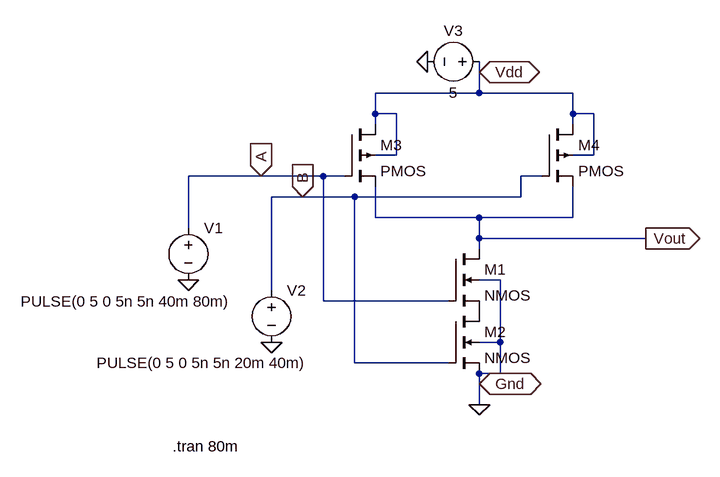
[diagram p0: schematic NAND.asc]
NAND.asc, the LTspice schematic file:
Version 4.1
SHEET 1 880 680
WIRE 288 -96 288 -112
WIRE 288 -64 288 -96
WIRE 288 -64 128 -64
WIRE 432 -64 288 -64
WIRE 128 -32 128 -64
WIRE 160 -32 128 -32
WIRE 432 -32 432 -64
WIRE 464 -32 432 -32
WIRE 128 -16 128 -32
WIRE 432 -16 432 -32
WIRE 160 32 160 -32
WIRE 160 32 128 32
WIRE 464 32 464 -32
WIRE 464 32 432 32
WIRE -48 64 -160 64
WIRE 48 64 -48 64
WIRE 80 64 48 64
WIRE 384 64 352 64
WIRE 16 96 -32 96
WIRE 96 96 16 96
WIRE 352 96 352 64
WIRE 352 96 96 96
WIRE 128 128 128 80
WIRE 288 128 128 128
WIRE 432 128 432 80
WIRE 432 128 288 128
WIRE -160 144 -160 64
WIRE 288 160 288 128
WIRE 544 160 288 160
WIRE 288 176 288 160
WIRE 320 224 288 224
WIRE -32 240 -32 96
WIRE 48 256 48 64
WIRE 240 256 48 256
WIRE 320 320 320 224
WIRE 320 320 288 320
WIRE 96 352 96 96
WIRE 240 352 96 352
WIRE 320 368 320 320
WIRE 320 368 288 368
WIRE 288 384 288 368
WIRE 288 416 288 384
FLAG 288 416 0
FLAG -32 320 0
FLAG -160 224 0
FLAG 208 -112 0
FLAG -48 64 A
IOPIN -48 64 In
FLAG 16 96 B
IOPIN 16 96 In
FLAG 288 -96 Vdd
IOPIN 288 -96 BiDir
FLAG 288 384 Gnd
IOPIN 288 384 BiDir
FLAG 544 160 Vout
IOPIN 544 160 Out
SYMBOL nmos4 240 176 R0
SYMATTR InstName M1
SYMBOL nmos4 240 272 R0
SYMATTR InstName M2
SYMBOL pmos4 80 -16 R0
SYMATTR InstName M3
SYMBOL pmos4 384 -16 R0
SYMATTR InstName M4
SYMBOL voltage -160 128 R0
WINDOW 3 -258 129 Left 2
WINDOW 123 0 0 Left 0
WINDOW 39 0 0 Left 0
SYMATTR Value PULSE(0 5 0 5n 5n 40m 80m)
SYMATTR InstName V1
SYMBOL voltage -32 224 R0
WINDOW 3 -269 128 Left 2
WINDOW 123 0 0 Left 0
WINDOW 39 0 0 Left 0
SYMATTR Value PULSE(0 5 0 5n 5n 20m 40m)
SYMATTR InstName V2
SYMBOL voltage 304 -112 R90
WINDOW 0 -32 56 VBottom 2
WINDOW 3 32 56 VTop 2
WINDOW 123 0 0 Left 0
WINDOW 39 0 0 Left 0
SYMATTR InstName V3
SYMATTR Value 5
TEXT -184 480 Left 2 !.tran 80m

The netlist it stands for:
* NAND.asc
M1 Vout A P001 0 NMOS
M2 P001 B 0 0 NMOS
M3 Vdd A Vout Vdd PMOS
M4 Vdd B Vout Vdd PMOS
V1 A 0 PULSE(0 5 0 5n 5n 40m 80m)
V2 B 0 PULSE(0 5 0 5n 5n 20m 40m)
V3 Vdd 0 5
.model NMOS NMOS
.model PMOS PMOS
.lib standard.mos
.tran 80m
.backanno
.end